# Altium schematic sheet AGC.SchDoc: AGC_SCH
size A4; Author: Hojnadel - Salazar Ato; Revision: Rev1.0; SheetNumber: 4; SheetTotal: 6
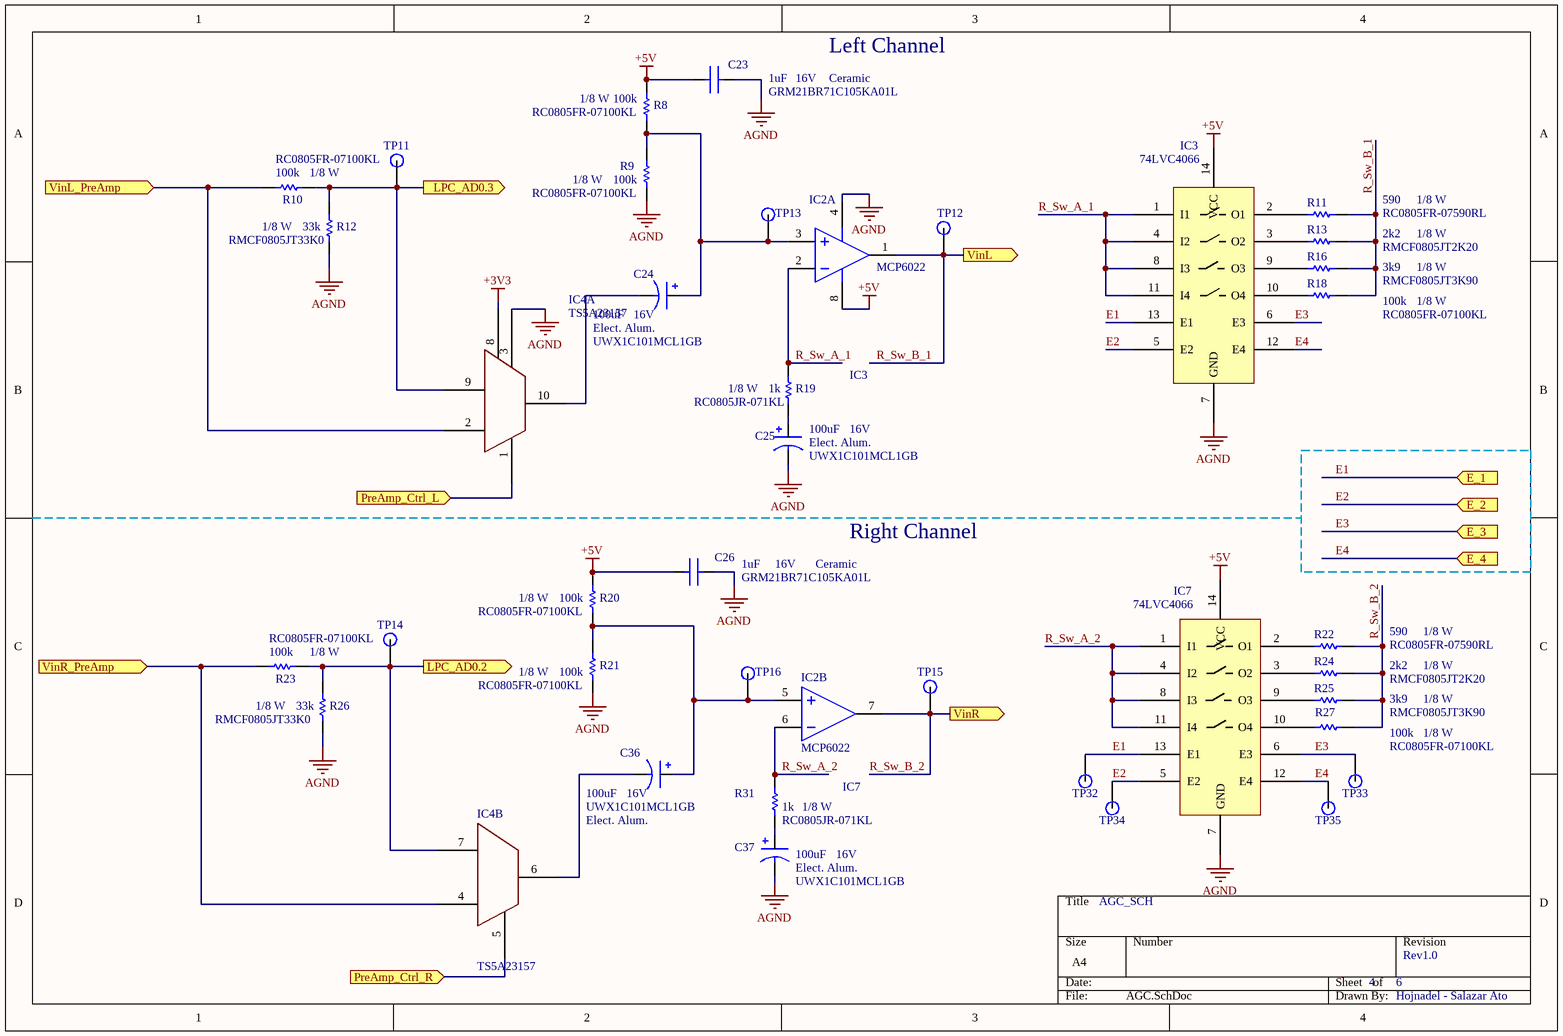
[diagram p0: AGC.SchDoc]

## Parts
C23  C: 1uF  V: 16V  Part Number: GRM21BR71C105KA01L  Material: Ceramic  [C_0805]  (hidden comment: 1uF 16V Ceramic)
C24  C: 100uF  V: 16V  Material: Elect. Alum.  Part number: UWX1C101MCL1GB  [C_AE7066X54M]  (hidden comment: 100uF 16V Elect. Alum.)
C25  C: 100uF  V: 16V  Material: Elect. Alum.  Part number: UWX1C101MCL1GB  [C_AE7066X54M]  (hidden comment: 100uF 16V Elect. Alum.)
C26  C: 1uF  V: 16V  Part Number: GRM21BR71C105KA01L  Material: Ceramic  [C_0805]  (hidden comment: 1uF 16V Ceramic)
C36  C: 100uF  V: 16V  Material: Elect. Alum.  Part number: UWX1C101MCL1GB  [C_AE7066X54M]  (hidden comment: 100uF 16V Elect. Alum.)
C37  C: 100uF  V: 16V  Material: Elect. Alum.  Part number: UWX1C101MCL1GB  [C_AE7066X54M]  (hidden comment: 100uF 16V Elect. Alum.)
IC2  MCP6022  [SOIC_D8]  (parts A,B of 2)
IC3  74LVC4066  [SO14]
IC4  TS5A23157  [TSSOP50P490X110-10N]  (parts A,B of 2)
IC7  74LVC4066  [SO14]
R8  value 100k  Power: 1/8 W  Part Number: RC0805FR-07100KL  [R_0805]  (hidden comment: 100k 1/8W)
R9  value 100k  Power: 1/8 W  Part Number: RC0805FR-07100KL  [R_0805]  (hidden comment: 100k 1/8W)
R10  value 100k  Power: 1/8 W  Part Number: RC0805FR-07100KL  [R_0805]  (hidden comment: 100k 1/8W)
R11  value 590  Power: 1/8 W  Part Number: RC0805FR-07590RL  [R_0805]  (hidden comment: 590 1/8W)
R12  value 33k  Power: 1/8 W  Part Number: RMCF0805JT33K0  [R_0805]  (hidden comment: 33k 1/8W)
R13  value 2k2  Power: 1/8 W  Part Number: RMCF0805JT2K20  [R_0805]  (hidden comment: 2k2 1/8W)
R16  value 3k9  Power: 1/8 W  Part Number: RMCF0805JT3K90  [R_0805]  (hidden comment: 3k9 1/8W)
R18  value 100k  Power: 1/8 W  Part Number: RC0805FR-07100KL  [R_0805]  (hidden comment: 100k 1/8W)
R19  value 1k  Power: 1/8 W  Part Number: RC0805JR-071KL  [R_0805]  (hidden comment: 1k 1/8W)
R20  value 100k  Power: 1/8 W  Part Number: RC0805FR-07100KL  [R_0805]  (hidden comment: 100k 1/8W)
R21  value 100k  Power: 1/8 W  Part Number: RC0805FR-07100KL  [R_0805]  (hidden comment: 100k 1/8W)
R22  value 590  Power: 1/8 W  Part Number: RC0805FR-07590RL  [R_0805]  (hidden comment: 590 1/8W)
R23  value 100k  Power: 1/8 W  Part Number: RC0805FR-07100KL  [R_0805]  (hidden comment: 100k 1/8W)
R24  value 2k2  Power: 1/8 W  Part Number: RMCF0805JT2K20  [R_0805]  (hidden comment: 2k2 1/8W)
R25  value 3k9  Power: 1/8 W  Part Number: RMCF0805JT3K90  [R_0805]  (hidden comment: 3k9 1/8W)
R26  value 33k  Power: 1/8 W  Part Number: RMCF0805JT33K0  [R_0805]  (hidden comment: 33k 1/8W)
R27  value 100k  Power: 1/8 W  Part Number: RC0805FR-07100KL  [R_0805]  (hidden comment: 100k 1/8W)
R31  value 1k  Power: 1/8 W  Part Number: RC0805JR-071KL  [R_0805]  (hidden comment: 1k 1/8W)
TP11  TP  [TP]  (value not drawn)
TP12  TP  [TP]  (value not drawn)
TP13  TP  [TP]  (value not drawn)
TP14  TP  [TP]  (value not drawn)
TP15  TP  [TP]  (value not drawn)
TP16  TP  [TP]  (value not drawn)
TP32  TP  [TP]  (value not drawn)
TP33  TP  [TP]  (value not drawn)
TP34  TP  [TP]  (value not drawn)
TP35  TP  [TP]  (value not drawn)

## Ports
E_1 (in), E_2 (in), E_3 (in), E_4 (in), LPC_AD0.2 (out), LPC_AD0.3 (out), PreAmp_Ctrl_L (in), PreAmp_Ctrl_R (in), VinL (out), VinL_PreAmp (in), VinR (out), VinR_PreAmp (in)

## Nets
+3V3: IC4.8(VDD)
+5V: C23.1 C26.1 IC2.8(VDD) IC3.14(VCC) IC7.14(VCC) R8.2 R20.2
AGND: C23.2 C25.2 C26.2 C37.2 IC2.4(VSS) IC3.7(GND) IC4.3(DGND) IC7.7(GND) R9.1 R12.2 R21.1 R26.2
E1: IC3.13(E1) IC7.13(E1) TP32.1 ; port E_1
E2: IC3.5(E2) IC7.5(E2) TP34.1 ; port E_2
E3: IC3.6(E3) IC7.6(E3) TP33.1 ; port E_3
E4: IC3.12(E4) IC7.12(E4) TP35.1 ; port E_4
LPC_AD0.2: IC4.7(NC2) R23.2 R26.1 TP14.1 ; port LPC_AD0.2
LPC_AD0.3: IC4.9(NC1) R10.2 R12.1 TP11.1 ; port LPC_AD0.3
PreAmp_Ctrl_L: IC4.1(IN1) ; port PreAmp_Ctrl_L
PreAmp_Ctrl_R: IC4.5(IN2) ; port PreAmp_Ctrl_R
R_Sw_A_1: IC2.2(IN-) IC3.1(I1) IC3.4(I2) IC3.8(I3) IC3.11(I4) R19.1
R_Sw_A_2: IC2.6(IN-) IC7.1(I1) IC7.4(I2) IC7.8(I3) IC7.11(I4) R31.1
R_Sw_B_1: IC2.1(OUT) R11.1 R13.1 R16.1 R18.1 TP12.1 ; port VinL
R_Sw_B_2: IC2.7(OUT) R22.1 R24.1 R25.1 R27.1 TP15.1 ; port VinR
VinL_PreAmp: IC4.2(NO1) R10.1 ; port VinL_PreAmp
VinR_PreAmp: IC4.4(NO2) R23.1 ; port VinR_PreAmp
NetC24_1: C24.1 IC2.3(IN+) R8.1 R9.2 TP13.1
NetC24_2: C24.2 IC4.10(COM1)
NetC25_1: C25.1 R19.2
NetC36_1: C36.1 IC2.5(IN+) R20.1 R21.2 TP16.1
NetC36_2: C36.2 IC4.6(COM2)
NetC37_1: C37.1 R31.2
NetIC3_2: IC3.2(O1) R11.2
NetIC3_3: IC3.3(O2) R13.2
NetIC3_9: IC3.9(O3) R16.2
NetIC3_10: IC3.10(O4) R18.2
NetIC7_2: IC7.2(O1) R22.2
NetIC7_3: IC7.3(O2) R24.2
NetIC7_9: IC7.9(O3) R25.2
NetIC7_10: IC7.10(O4) R27.2

## Notes on the sheet
- Left Channel
- IC3
- Right Channel
- IC7

## Library data of the parts
C23 C26 = Cap1: Capacitor
C24 C25 C36 C37 = Cap_Elec: Capacitor
IC2 = OpAmp_Dual
IC3 IC7 = Q_B_Switch_2: Part Number: 74LVC4066BQ,115
IC4 = A_SW_2x2:1_VSSOP: Analog Switch; Part Number: TS5A23157
R8-R13 R16 R18-R27 R31 = Res1: Resistor
TP11-TP16 TP32-TP35 = Test Point